# EAGLE design Board (EAGLE 9.6.2)
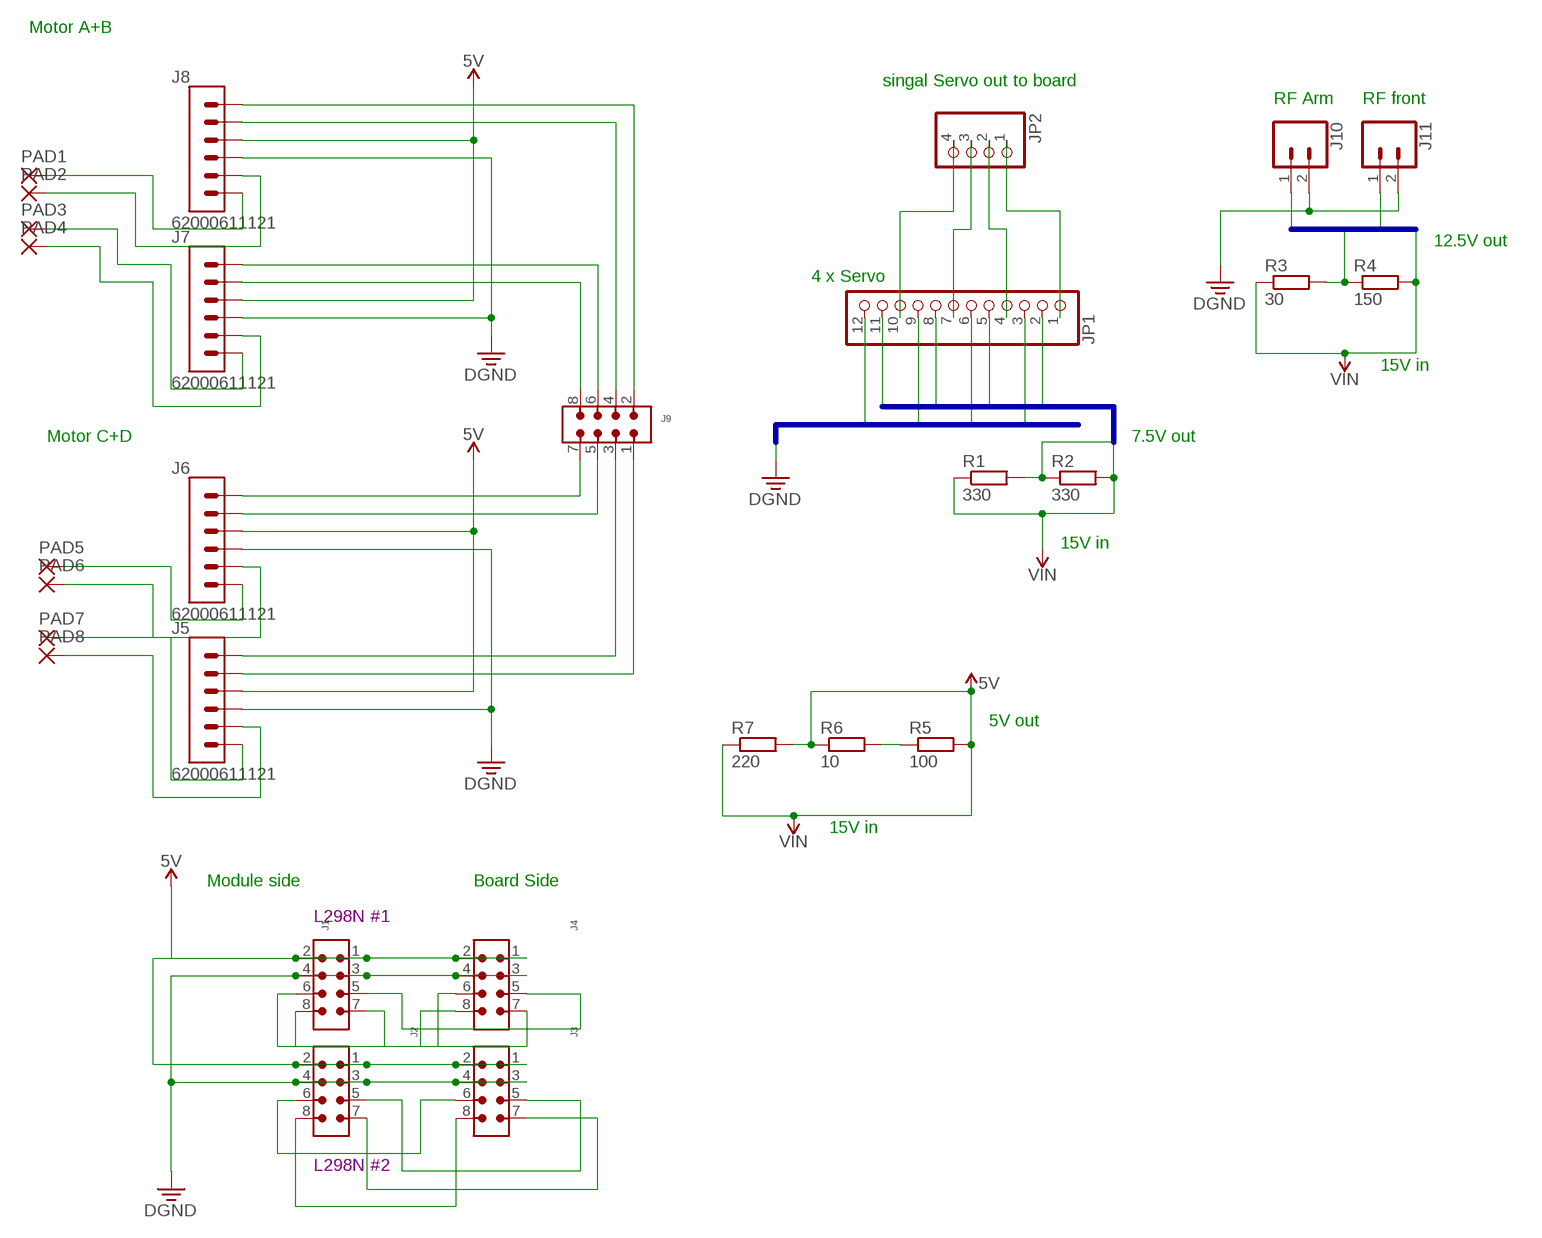
[diagram p0: schematic, sheet 1]

## Parts
J1  6130XX21021_61300821021  [61300821021]
J2  6130XX21021_61300821021  [61300821021]
J3  6130XX21021_61300821021  [61300821021]
J4  6130XX21021_61300821021  [61300821021]
J5  62000611121  [62000611121]
J6  62000611121  [62000611121]
J7  62000611121  [62000611121]
J8  62000611121  [62000611121]
J9  6130XX21021_61300821021  [61300821021]
J10  CONN_02LOCK_LONGPADS  [1X02_LOCK_LONGPADS]
J11  CONN_02LOCK_LONGPADS  [1X02_LOCK_LONGPADS]
JP1  PINHD-1X12  [1X12]
JP2  PINHD-1X4/90  [1X04/90]
PAD1  3,17/1,3  [3,17/1,3]
PAD2  3,17/1,3  [3,17/1,3]
PAD3  3,17/1,3  [3,17/1,3]
PAD4  3,17/1,3  [3,17/1,3]
PAD5  3,17/1,3  [3,17/1,3]
PAD6  3,17/1,3  [3,17/1,3]
PAD7  3,17/1,3  [3,17/1,3]
PAD8  3,17/1,3  [3,17/1,3]
R1  330  R0207/10  [0207/10]
R2  330  R0207/10  [0207/10]
R3  30  R0207/10  [0207/10]
R4  150  R0207/10  [0207/10]
R5  100  R0207/10  [0207/10]
R6  10  R0207/10  [0207/10]
R7  220  R0207/10  [0207/10]

## Nets
5V: J1.1 J1.2 J2.1 J2.2 J3.1 J3.2 J4.1 J4.2 J5.3 J6.3 J7.3 J8.3
B$1: JP1.3 JP1.6 JP1.9 JP1.12 ; supply symbol labelled DGND
B$2: JP1.2 JP1.5 JP1.8 JP1.11 R1.1 R1.2 R2.1 R2.2 ; supply symbol labelled VIN
B$3: J10.1 J11.1 R3.1 R3.2 R4.1 R4.2 ; supply symbol labelled VIN
DGND: J1.3 J1.4 J2.3 J2.4 J3.3 J3.4 J4.3 J4.4 J5.4 J6.4 J7.4 J8.4 J10.2 J11.2
N$1: J1.8 J4.8
N$2: J1.6 J4.6
N$3: J1.7 J4.7
N$4: J2.5 J3.5
N$5: J1.5 J4.5
N$6: J2.7 J3.7
N$7: J2.8 J3.8
N$8: J2.6 J3.6
N$9: J6.6 PAD5.1(P)
N$10: J5.6 PAD7.1(P)
N$11: J6.5 PAD6.1(P)
N$12: J5.5 PAD8.1(P)
N$13: J8.6 PAD1.1(P)
N$14: J8.5 PAD2.1(P)
N$15: J7.6 PAD3.1(P)
N$16: J7.5 PAD4.1(P)
N$17: J5.2 J9.1
N$18: J5.1 J9.3
N$19: J6.2 J9.5
N$20: J6.1 J9.7
N$21: J7.2 J9.8
N$22: J7.1 J9.6
N$23: J8.2 J9.4
N$24: J8.1 J9.2
N$25: JP1.1 JP2.1
N$26: JP1.4 JP2.2
N$27: JP1.7 JP2.3
N$28: JP1.10 JP2.4
N$31: R5.1 R6.2
VIN: R5.2 R6.1 R7.1 R7.2 ; supply symbol labelled 5V

## Buses
B$1
B$2
B$3

## Notes on the sheet
- Motor A+B
- singal Servo out to board
- RF Arm | RF front
- 12.5V out
- 4 x Servo
- 15V in
- Motor C+D | 7.5V out
- 15V in
- 5V out
- 15V in
- Module side | Board Side
- L298N #1
- L298N #2

## Library data of the parts
J1-J4 J9 = Wurth_Connectors_WR-PHD:6130XX21021_61300821021: WR-PHD 2.54 mm THT Angled Dual Pin Header ARTICLE PROPERTIES: Pins:4;​ 6;​ 8;​ 10;​ 12;​ 14;​ 16;​ 18;​ 20;​ 22;​ 24;​ 26;​ 32;​ 34;​ 36;​ 40;​ 64;​ 72 KIND PROPERTIES: Pitch：2.54 mm Quality Class:3 as per CECC 75 301-802 Rows：Dual Gender：Pin Header Type：Angled;​ Board Stacker MATERIAL PROPERTIES: Insulator Material :PA6T Insulator Flammability Rating:UL94 V-0 Contact Material:Copper Alloy Contact Plating:Gold Contact Type:Stamped GENERAL INFORMATION Operating Temperature:-40 up to +105 °C Compliance:RoHS ELECTRICAL PROPERTIES: Rated Current:3 A IR 1:3 A Withstanding Voltage:500 V (AC) Contact Resistance:20 mΩ RISO:1000 MΩ CERTIFICATION UL Approval:E323964 PACKAGING PROPERTIES Packaging:Bag <https://katalog.we-online.com/media/images/v2/o33214v209%20Family_wr-phd_6130XX21021.jpg> Details see: https://katalog.we-online.com/en/em/PHD_2_54_THT_ANGLED_DUAL_PIN_HEADER_6130XX21021 Updated by Yingchun,Shan 2019-10-16 2019 (C) Würth Elektronik; DATASHEET-URL: https://katalog.we-online.com/em/datasheet/61300821021.pdf; GENDER: Pin Header; IR: 3A; MATES: WR-PHD 2.54mm Angled DualSocket Header/Dual Socket Header/Dual Socket Header Bottom Entry/Dual Socket Header Bottom Entry Large/SMT Dual Socket Header/SMT Dual Socket Header Bottom Entry; PACKAGING: Bag; PART-NUMBER: 61300821021; PINS: 8; ROWS: Dual; TYPE: Angled
J5-J8 = Headers:62000611121: THT Vertical Pin Header WR-PHD, Pitch 2.00 mm, Single Row, 6 pins Manufacturer's datasheet <https://datasheet.octopart.com/62000611121-W%C3%BCrth-Elektronik-datasheet-117282008.pdf>; CREATED_BY: PCBLayout.com; MANUFACTURER: Würth Elektronik; MPN: 62000611121
J10 J11 = SparkFun-Connectors:CONN_02: Multi connection point. Often used as Generic Header-pin footprint for 0.1 inch spaced/style header connections On any of the 0.1 inch spaced packages, you can populate with these: Break Away Headers - Straight <https://www.sparkfun.com/products/116> (PRT-00116) Break Away Male Headers - Right Angle <https://www.sparkfun.com/products/553> (PRT-00553) Female Headers <https://www.sparkfun.com/products/115> (PRT-00115) Break Away Headers - Machine Pin <https://www.sparkfun.com/products/117> (PRT-00117) Break Away Female Headers - Swiss Machine Pin <https://www.sparkfun.com/products/743> (PRT-00743) For SCREWTERMINALS and SPRING TERMINALS visit here: Screw Terimnals on SparkFun.com <https://www.sparkfun.com/search/results?term=Screw+Terminals> (5mm/3.5mm/2.54mm spacing) This device is also useful as a general connection point to wire up your design to another part of your project. Our various solder wires solder well into these plated through hole pads. Hook-Up Wire - Assortment (Stranded, 22 AWG) <https://www.sparkfun.com/products/11375> (PRT-11375) Hook-Up Wire - Assortment (Solid Core, 22 AWG) <https://www.sparkfun.com/products/11367> (PRT-11367) View the entire wire category on our website here <https://www.sparkfun.com/categories/141> Special notes: Molex polarized connector foot print use with: PRT-08233 with associated crimp pins and housings. 2.54_SCREWTERM for use with PRT-10571. 3.5mm Screw Terminal footprints for PRT-08084 5mm Screw Terminal footprints for use with PRT-08432
JP1 = adafruit:PINHD-1X12: PIN HEADER
JP2 = pinhead:PINHD-1X4: PIN HEADER
PAD1-PAD8 = wirepad:3,17/1,3: THROUGH-HOLE PAD
R1-R7 = eagle-ltspice:R: RESISTOR, European symbol; SPICEMODEL: NONE; SPICEPREFIX: R

## Board
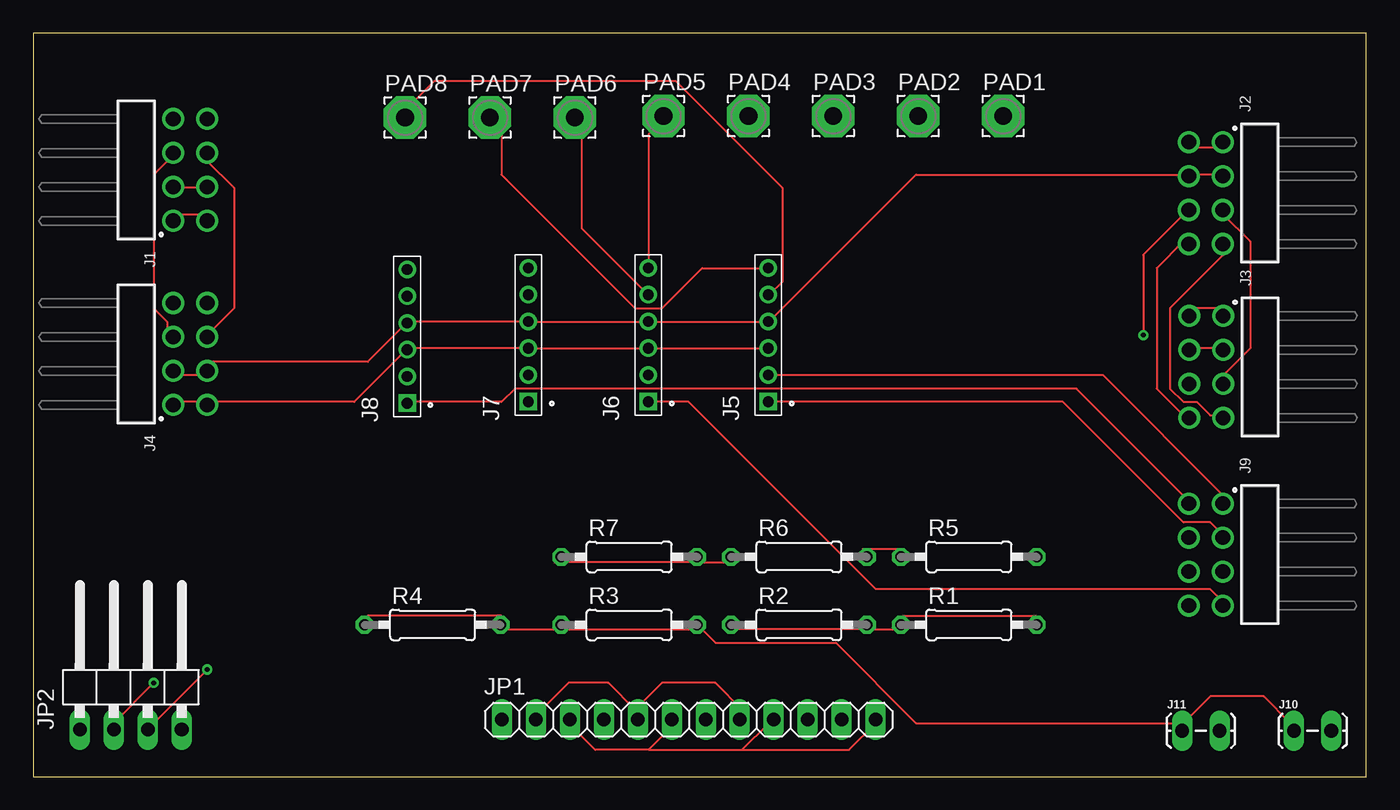
[diagram p1: board, top side]
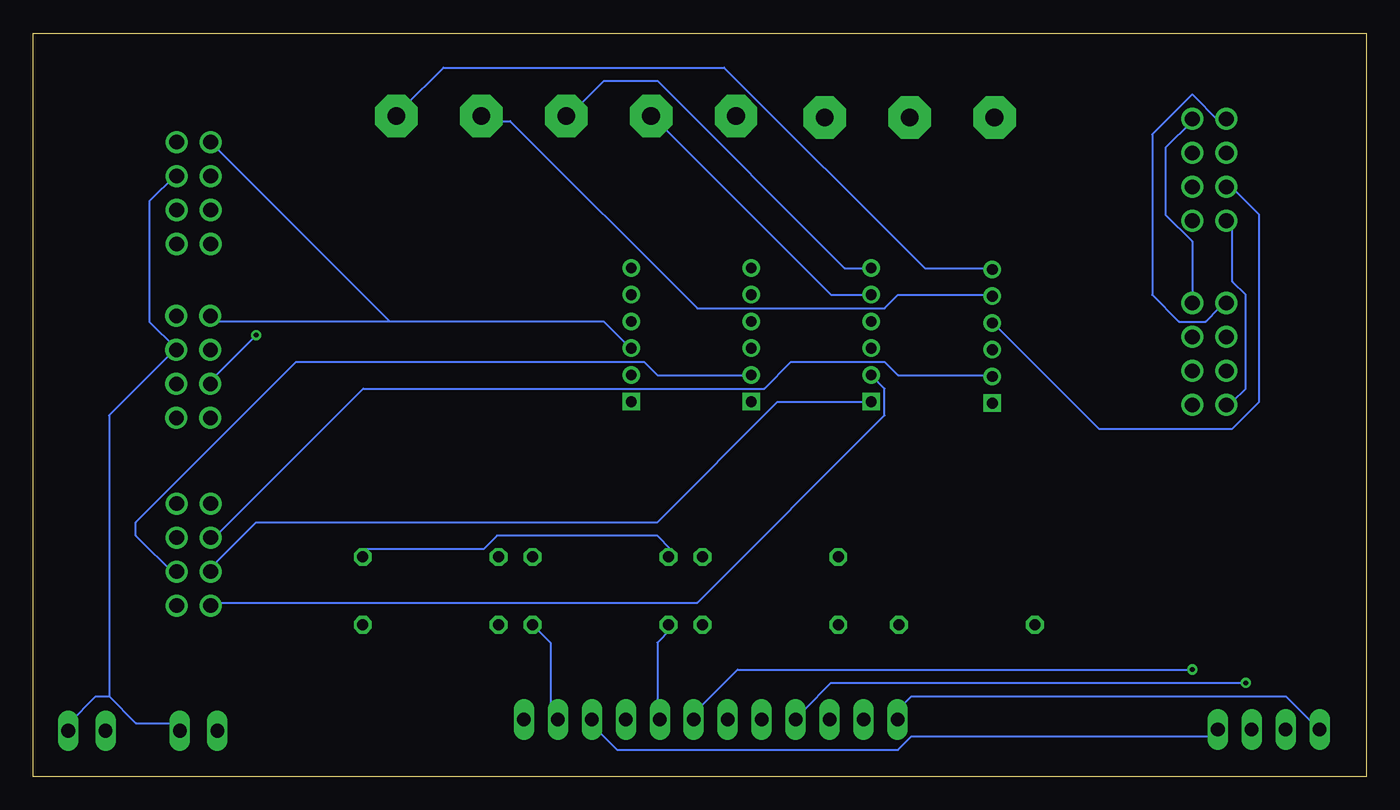
[diagram p2: board, bottom side, seen from below]

Size 99.66 x 55.55 mm. Coordinates in mm from the lower left corner, seen from the top.
Outline: 0,0 99.66,0 99.66,55.55 0,55.55 0,0
Copper layers (1*16): Top 0.035mm / dielectric 1.5mm / Bottom 0.035mm
Design rules "default": minimum track width 6mil, minimum drill 0.35mm, track to track 6mil, track to pad 6mil, pad to pad 6mil, via to via 6mil, smd to smd 6mil, copper to edge 40mil, drill to drill 6mil, minimum pad ring 10mil, minimum via ring 8mil, stop-mask expansion 4mil, vias tented up to drill 0mil, thermal gap 10mil

### Footprints (pad centres in the part's own frame; a part is rotated, then mirrored left to right if it is on the bottom)
61300821021 = drill 1.1: 1 3.81,2.77; 2 3.81,5.31; 3 1.27,2.77; 4 1.27,5.31; 5 -1.27,2.77; 6 -1.27,5.31; 7 -3.81,2.77; 8 -3.81,5.31
62000611121 = drill 0.8 square: 1 -5,0 | drill 0.8: 2 -3,0; 3 -1,0; 4 1,0; 5 3,0; 6 5,0
1X02_LOCK_LONGPADS = drill 1.016 long: 1 -0.127,0; 2 2.667,0
1X12 = drill 1.016 long: 1 -13.97,0; 2 -11.43,0; 3 -8.89,0; 4 -6.35,0; 5 -3.81,0; 6 -1.27,0; 7 1.27,0; 8 3.81,0; 9 6.35,0; 10 8.89,0; 11 11.43,0; 12 13.97,0
1X04/90 = drill 1.016 long: 1 -3.81,-3.81; 2 -1.27,-3.81; 3 1.27,-3.81; 4 3.81,-3.81
3,17/1,3 = drill 1.321 pad 3.175 octagon: 1 0,0
0207/10 = drill 0.813 octagon: 1 -5.08,0; 2 5.08,0

### Placement (x,y rotation side)
J1  7.68,45.35 270 top
J2  91.71,43.62 90 top
J3  91.74,30.62 90 top
J4  7.68,31.59 270 top
J5  54.95,33.02 90 top
J6  45.98,33.02 90 top
J7  37.01,33.02 90 top
J8  27.95,32.91 90 top
J9  91.71,16.59 90 top
J10  94.39,3.42 0 top
J11  86.04,3.42 0 top
JP1  49.01,4.26 0 top
JP2  7.28,7.32 0 top
PAD1  72.52,49.37 0 top
PAD2  66.17,49.37 0 top
PAD3  59.82,49.37 0 top
PAD4  53.47,49.37 0 top
PAD5  47.12,49.37 0 top
PAD6  40.49,49.26 0 top
PAD7  34.14,49.26 0 top
PAD8  27.79,49.26 0 top
R1  69.95,11.34 0 top
R2  57.25,11.34 0 top
R3  44.55,11.34 0 top
R4  29.85,11.34 0 top
R5  69.95,16.42 0 top
R6  57.25,16.42 0 top
R7  44.55,16.42 0 top

### Tracks (layer width: path | path; a pad name or v marks a point on that pad's centre or on a via)
5V
  Top 0.152: J2.2 87,47 89,47 J2.1 | J3.2 87,35 89,35 J3.1 | J1.1 11,42 13,42 J1.2 | 13,28 11,28 J4.1 | 37,32 28,32 | 37,32 46,32 | 37,32 J7.3 | 46,32 55,32 J5.3 | 46,32 J6.3 | 13,28 24,28 28,32 | 13,28 J4.2 | 28,32 J8.3
  Bottom 0.152: J1.1 10,41 10,37 9,36 9,29 10,28 J4.1 | 73,34 57,34 55,32 J5.3 | 73,34 86,34 J3.2 | 73,34 86,47 J2.2
B$1
  Top 0.152: 46,2 42,2 40,4 JP1.3 | 46,2 48,4 JP1.6 | 53,2 55,4 JP1.9 | 46,2 53,2 | 53,2 61,2 63,4 JP1.12
B$2
  Top 0.152: 45,5 43,7 40,7 38,5 JP1.2 | 62,11 52,11 R2.1 | 62,11 65,11 R1.1 65,12 75,12 R1.2 | 62,11 R2.2 | 45,5 47,7 51,7 53,5 JP1.8 | 45,5 JP1.5
  Bottom 0.152: JP1.8 53,5 53,10 52,11 R2.1 | JP1.11 61,5 61,10 62,11 R2.2
B$3
  Top 0.152: 86,4 88,6 92,6 94,4 J10.1 | R4.1 25,12 35,12 R4.2 35,11 39,11 R3.1 40,11 50,11 | 86,4 66,4 60,10 51,10 50,11 | 86,4 J11.1 | 50,11 R3.2
DGND
  Top 0.152: J3.4 87,32 89,32 J3.3 | J2.3 89,45 87,45 J2.4 86,45 66,45 55,34 | J1.3 11,44 13,44 J1.4 | J4.3 11,30 13,30 J4.4 13,31 25,31 28,34 | 37,34 28,34 | 37,34 46,34 | 37,34 J7.4 | 46,34 55,34 | 46,34 J6.4 | 28,34 J8.4 | 55,34 J5.4
  Bottom 0.152: 94,6 92,4 89,4 J11.2 | 94,6 95,6 97,4 J10.2 | 89,32 91,34 91,43 89,45 J2.3 | 94,6 94,27 89,32 | 89,32 J3.3 | J1.3 10,44 8,42 8,28 10,26 20,26 28,34 J8.4
N$1
  Bottom 0.152: J4.8 13,36 13,40 15,42 15,47 13,49 J1.8
N$2
  Top 0.152: J4.6 13,33 15,35 15,44 13,46 J1.6
N$3
  Bottom 0.152: J4.7 11,35 12,34 14,34 16,36 16,48 13,51 11,49 J1.7
N$4
  Top 0.152: J3.5 89,30 91,32 91,40 89,42 J2.5
N$5
  Top 0.152: J4.5 10,33 10,34 9,35 9,45 10,46 J1.5
N$6
  Top 0.152: J3.7 89,27 88,27 87,28 86,28 85,29 85,35 89,39 J2.7
N$7
  Top 0.152: J3.8 86,27 84,29 84,38 86,40 J2.8
N$8  (via drill 0.35)
  Top 0.152: v83,33 83,39 86,42 J2.6
  Bottom 0.152: v83,33 86,30 J3.6
N$9
  Top 0.152: J6.6 46,38 46,48 47,49 PAD5.1
N$10
  Top 0.152: J5.6 55,38 50,38 47,35 45,35 35,45 35,49 PAD7.1
N$11
  Top 0.152: 46,36 J6.5 41,41 41,49 PAD6.1
N$12
  Top 0.152: J5.5 55,36 56,37 56,44 48,52 30,52 28,50 PAD8.1
N$13
  Bottom 0.152: J8.6 28,38 33,38 48,53 69,53 72,50 PAD1.1
N$14
  Bottom 0.152: J8.5 28,36 35,36 36,35 50,35 64,49 66,49 PAD2.1
N$15
  Bottom 0.152: J7.6 37,38 39,38 53,52 57,52 59,50 PAD3.1
N$16
  Bottom 0.152: J7.5 37,36 40,36 53,49 PAD4.1
N$17
  Top 0.152: J5.2 55,30 80,30 89,21 J9.1
N$18
  Top 0.152: J5.1 55,28 77,28 86,19 88,19 89,18 J9.3
N$19
  Bottom 0.152: J6.2 46,30 53,30 54,31 80,31 92,19 92,18 89,15 J9.5
N$20
  Top 0.152: J6.1 46,28 49,28 63,14 88,14 89,13 J9.7
N$21
  Bottom 0.152: J7.2 37,30 36,29 36,27 50,13 86,13 J9.8
N$22
  Bottom 0.152: J7.1 37,28 44,28 53,19 83,19 86,16 J9.6
N$23
  Bottom 0.152: J8.2 28,30 35,30 36,31 43,31 45,29 75,29 86,18 J9.4
N$24
  Top 0.152: J8.1 28,28 35,28 36,29 78,29 86,21 J9.2
N$25
  Bottom 0.152: JP2.1 4,4 6,6 34,6 35,5 JP1.1
N$26  (via drill 0.35)
  Top 0.152: v9,7 6,4 JP2.2
  Bottom 0.152: v9,7 40,7 42,5 JP1.4
N$27  (via drill 0.35)
  Top 0.152: v13,8 9,4 JP2.3
  Bottom 0.152: v13,8 47,8 50,5 JP1.7
N$28
  Bottom 0.152: JP2.4 11,3 34,3 35,2 56,2 58,4 JP1.10
N$31
  Top 0.152: R6.2 62,17 65,17 R5.1
VIN
  Top 0.152: 50,16 39,16 R7.1 | 50,16 52,16 R6.1 | 50,16 R7.2
  Bottom 0.152: R5.2 75,17 66,17 65,18 53,18 52,17 R6.1